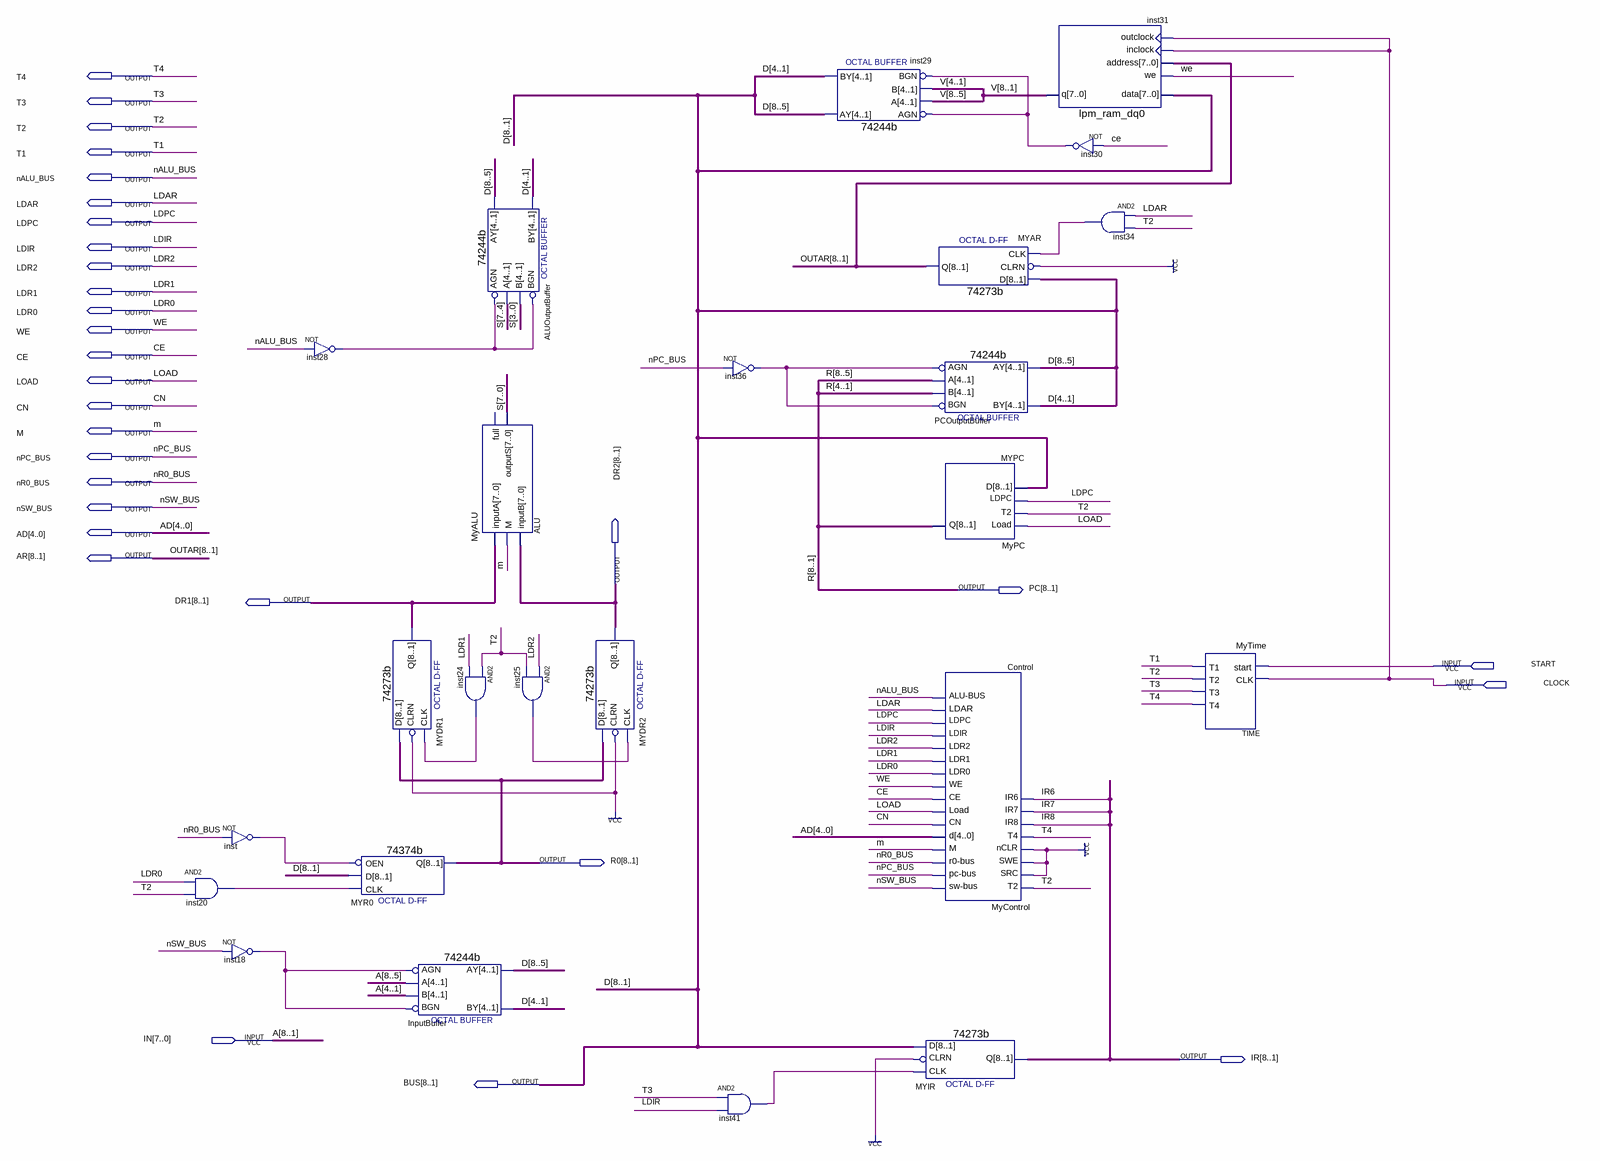
[diagram p0: schematic sheet]
// Quartus schematic MyCom.bdf as structural Verilog: 24 symbols, 30 pins
module MyCom (
  input  START,
  input  CLOCK,
  input  [7:0] IN,
  output T4,
  output T3,
  output T2,
  output T1,
  output nALU_BUS,
  output LDAR,
  output LDPC,
  output LDIR,
  output LDR2,
  output LDR1,
  output LDR0,
  output WE,
  output CE,
  output LOAD,
  output CN,
  output M,
  output nPC_BUS,
  output nR0_BUS,
  output nSW_BUS,
  output [4:0] AD,
  output [8:1] AR,
  output [8:1] DR2,
  output [8:1] PC,
  output [8:1] DR1,
  output [8:1] R0,
  output [8:1] IR,
  output [8:1] BUS
);

  wire inst18_out, inst20_out, inst24_out, inst25_out, inst28_out, inst30_out, inst34_out, inst36_out,
       inst41_out, inst_out;
  wire [7:0] S;
  wire [8:1] V;

  not inst (inst_out, nR0_BUS);
  and inst20 (inst20_out, LDR0, T2);
  not inst18 (inst18_out, nSW_BUS);
  not inst28 (inst28_out, nALU_BUS);
  \74273b  MYDR1 (.CLK(inst24_out), .D(R0), .CLRN(1'b1), .Q(DR1));
  \74374b  MYR0 (.D(BUS), .OEN(inst_out), .CLK(inst20_out), .Q(R0));
  \74244b  InputBuffer (.AGN(inst18_out), .B(IN[3:0]), .BGN(inst18_out), .A(IN[7:4]), .AY(BUS[8:5]), .BY(BUS[4:1]));
  \74244b  ALUOutputBuffer (.AGN(inst28_out), .B(S[3:0]), .BGN(inst28_out), .A(S[7:4]), .AY(BUS[8:5]), .BY(BUS[4:1]));
  MyALU ALU (.inputA(DR1), .M(M), .inputB(DR2), .outputS(S));  // open: full
  and inst24 (inst24_out, T2, LDR1);
  and inst25 (inst25_out, LDR2, T2);
  \74273b  MYDR2 (.CLK(inst25_out), .D(R0), .CLRN(1'b1), .Q(DR2));
  not inst36 (inst36_out, nPC_BUS);
  and inst41 (inst41_out, T3, LDIR);
  \74244b  inst29 (.AGN(inst30_out), .B(V[4:1]), .BGN(inst30_out), .A(V[8:5]), .AY(BUS[8:5]), .BY(BUS[4:1]));
  \74273b  MYAR (.CLK(inst34_out), .D(BUS), .CLRN(1'b1), .Q(AR));
  \74244b  PCOutputBuffer (.AGN(inst36_out), .B(PC[4:1]), .BGN(inst36_out), .A(PC[8:5]), .AY(BUS[8:5]), .BY(BUS[4:1]));
  MyPC MYPC (.Load(LOAD), .T2(T2), .LDPC(LDPC), .D(BUS), .Q(PC));
  MyControl Control (
    .T2(T2), .SRC(1'b1), .SWE(1'b1), .nCLR(1'b1), .T4(T4), .IR8(IR[8]), .IR7(IR[7]), .IR6(IR[6]),
    .\sw-bus (nSW_BUS), .\pc-bus (nPC_BUS), .\r0-bus (nR0_BUS), .M(M), .d(AD), .CN(CN), .Load(LOAD), .CE(CE),
    .WE(WE), .LDR0(LDR0), .LDR1(LDR1), .LDR2(LDR2), .LDIR(LDIR), .LDPC(LDPC), .LDAR(LDAR),
    .\ALU-BUS (nALU_BUS));
  \74273b  MYIR (.CLK(inst41_out), .D(BUS), .CLRN(1'b1), .Q(IR));
  lpm_ram_dq0 inst31 (.data(BUS), .we(WE), .address(AR), .inclock(CLOCK), .outclock(CLOCK), .q(V));
  not inst30 (inst30_out, CE);
  and inst34 (inst34_out, LDAR, T2);
  MyTime TIME (.start(START), .CLK(CLOCK), .T1(T1), .T2(T2), .T3(T3), .T4(T4));

  // Other names for the same wires on the sheet: A[8:1] = IN; D[8:1] = BUS; OUTAR[8:1] = AR; R[8:1] = PC
endmodule
